# Altium schematic sheet Output.SchDoc
size A4; Rules: TODO
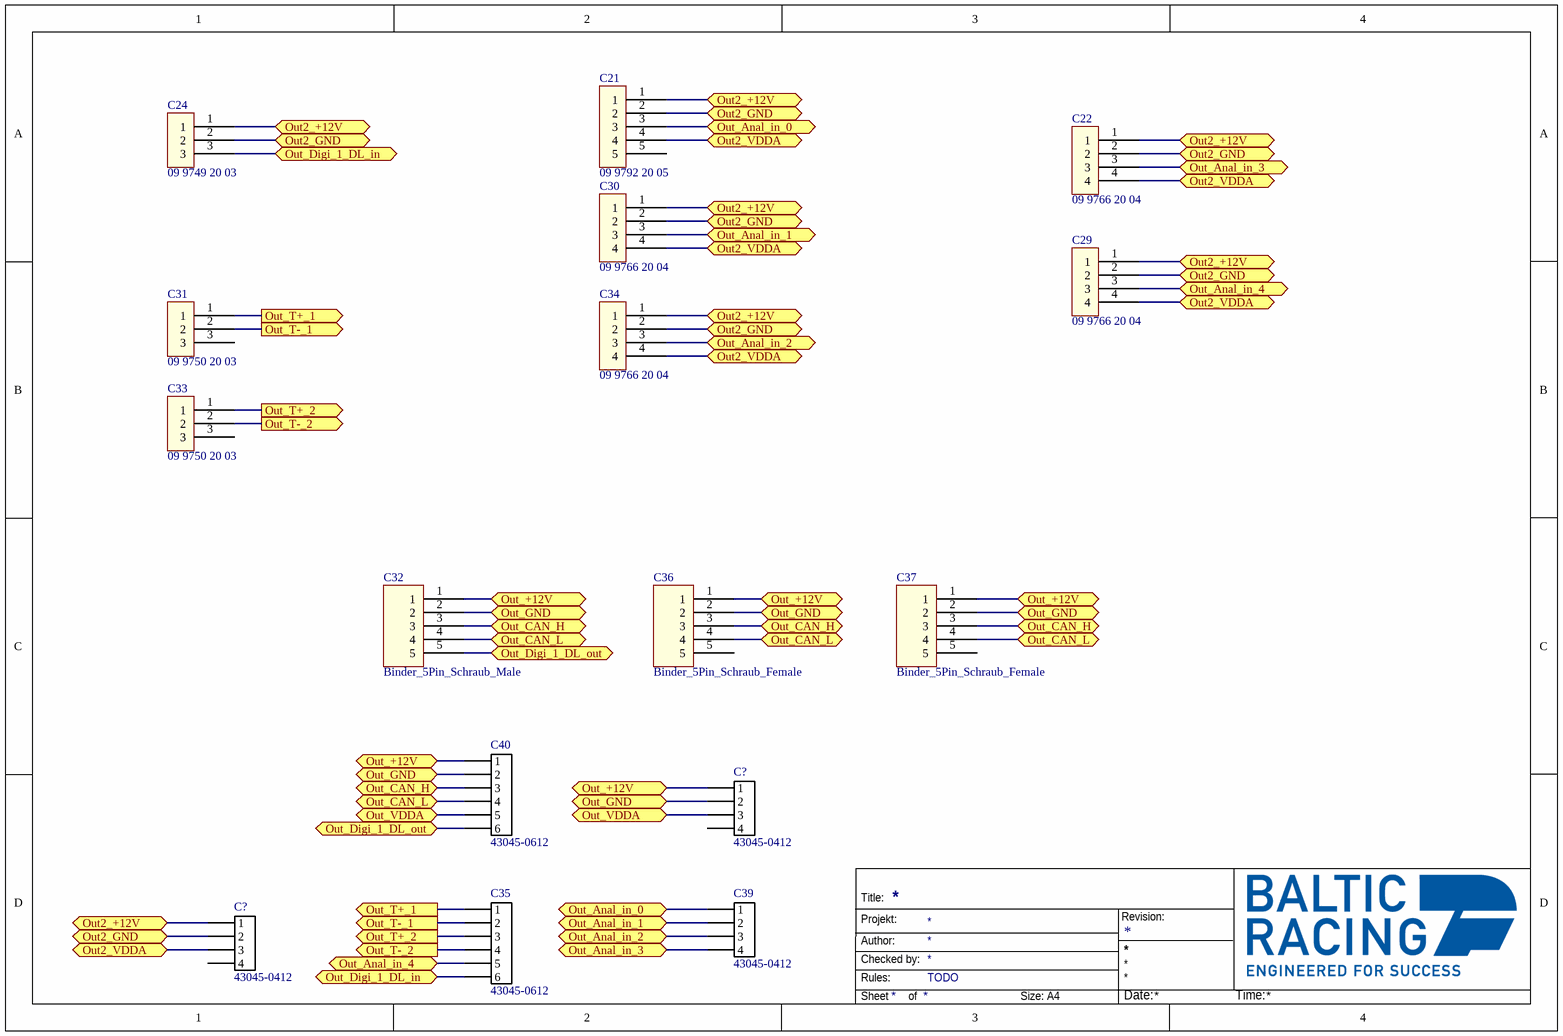
[diagram p0: Output.SchDoc]

## Parts
(Parts that share a designator on the sheet are numbered #1, #2 ... from top to bottom, then left to right.)
C21  09 9792 20 05  [09 9792 20 05]
C22  09 9766 20 04  [09 9766 20 04]
C24  09 9749 20 03  [09 9749 20 03]
C29  09 9766 20 04  [09 9766 20 04]
C30  09 9766 20 04  [09 9766 20 04]
C31  09 9750 20 03  [09 9750 20 03]
C32  Binder_5Pin_Schraub_Male  [09 0415 30 05]
C33  09 9750 20 03  [09 9750 20 03]
C34  09 9766 20 04  [09 9766 20 04]
C35  43045-0612  [43045-0612]
C36  Binder_5Pin_Schraub_Female  [09 0416 30 05]
C37  Binder_5Pin_Schraub_Female  [09 0416 30 05]
C39  43045-0412  [43045-0412]
C40  43045-0612  [43045-0612]
C?#1  43045-0412  [43045-0412]
C?#2  43045-0412  [43045-0412]

## Ports
Out2_+12V (bidir), Out2_GND (bidir), Out2_VDDA (bidir), Out_+12V (bidir), Out_Anal_in_0 (bidir), Out_Anal_in_1 (bidir), Out_Anal_in_2 (bidir), Out_Anal_in_3 (bidir), Out_Anal_in_4 (bidir), Out_CAN_H (bidir), Out_CAN_L (bidir), Out_Digi_1_DL_in (bidir), Out_Digi_1_DL_out (bidir), Out_GND (bidir), Out_T+_1 (out), Out_T+_2 (out), Out_T-_1 (out), Out_T-_2 (out), Out_VDDA (bidir)

## Nets
Out2_+12V: C21.1 C22.1 C24.1 C29.1 C30.1 C34.1 C?#2.1 ; port Out2_+12V
Out2_GND: C21.2 C22.2 C24.2 C29.2 C30.2 C34.2 C?#2.2 ; port Out2_GND
Out2_VDDA: C21.4 C22.4 C29.4 C30.4 C34.4 C?#2.3 ; port Out2_VDDA
Out_+12V: C32.1 C36.1 C37.1 C40.1 C?#1.1 ; port Out_+12V
Out_Anal_in_0: C21.3 C39.1 ; port Out_Anal_in_0
Out_Anal_in_1: C30.3 C39.2 ; port Out_Anal_in_1
Out_Anal_in_2: C34.3 C39.3 ; port Out_Anal_in_2
Out_Anal_in_3: C22.3 C39.4 ; port Out_Anal_in_3
Out_Anal_in_4: C29.3 C35.5 ; port Out_Anal_in_4
Out_CAN_H: C32.3 C36.3 C37.3 C40.3 ; port Out_CAN_H
Out_CAN_L: C32.4 C36.4 C37.4 C40.4 ; port Out_CAN_L
Out_Digi_1_DL_in: C24.3 C35.6 ; port Out_Digi_1_DL_in
Out_Digi_1_DL_out: C32.5 C40.6 ; port Out_Digi_1_DL_out
Out_GND: C32.2 C36.2 C37.2 C40.2 C?#1.2 ; port Out_GND
Out_T+_1: C31.1 C35.1 ; port Out_T+_1
Out_T+_2: C33.1 C35.3 ; port Out_T+_2
Out_T-_1: C31.2 C35.2 ; port Out_T-_1
Out_T-_2: C33.2 C35.4 ; port Out_T-_2
Out_VDDA: C40.5 C?#1.3 ; port Out_VDDA

Not connected (* = marked no-connect by the designer): C21 5; C31 3; C33 3; C36 5; C37 5; C?#1 4; C?#2 4

## Notes on the sheet
- Title:
- Projekt:
- Revision:
- Author:
- Rules:
- Checked by:
- Sheet
- of
- Size:
- A4
- Date:
- Time:

## Library data of the parts
C21 = 09 9792 20 05: Binder 5 Pin Female SnapIn
C22 C29 C30 C34 = 09 9766 20 04: Binder 4 Pin Female SnapIn
C24 = 09 9749 20 03: Binder 3 Pin Male SnapIn
C31 C33 = 09 9750 20 03: Binder 3 Pin Female SnapIn
C35 C40 = MicroFit3.0 6-Pin: Molex Micro-Fit 3.0 6-Pin / 600V / 8.5A
C39 C?#1 C?#2 = MicroFit3.0 4-Pin: Molex Micro-Fit 3.0 4-Pin / 600V / 8.5A